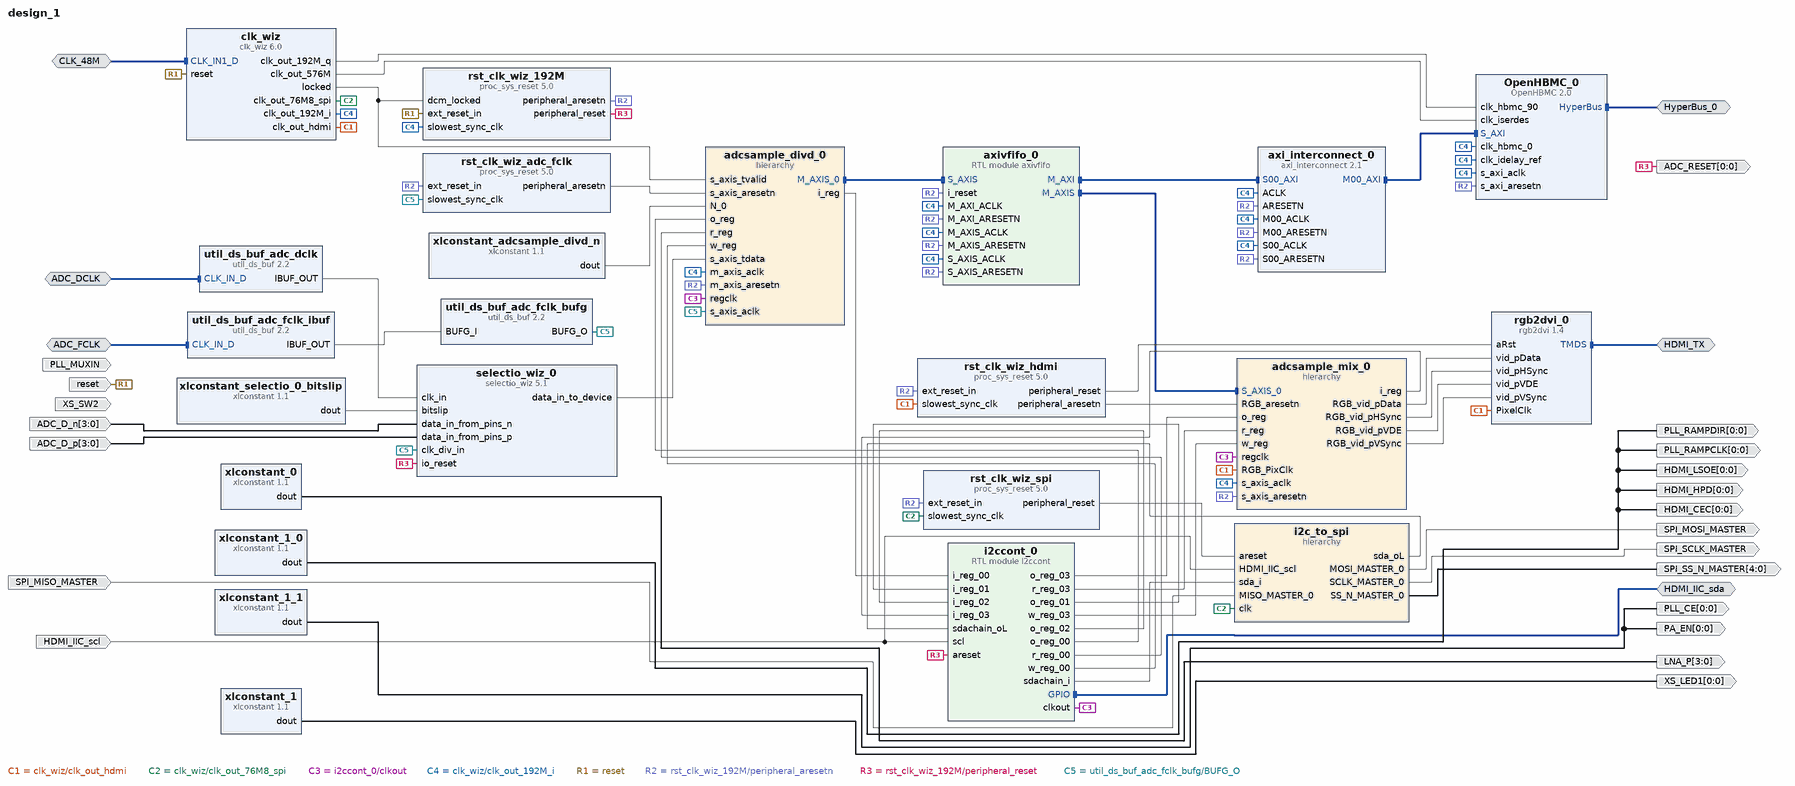
[diagram p0: block diagram of the top level]
# Vivado block design design_1, xc7s15csga225-1, Vivado 2021.2
create_bd_design design_1

create_bd_intf_port -mode Slave -vlnv xilinx.com:interface:diff_clock_rtl:1.0 ADC_FCLK
set_property -dict {CONFIG.FREQ_HZ 48000000} [get_bd_intf_ports ADC_FCLK]
create_bd_intf_port -mode Slave -vlnv xilinx.com:interface:diff_clock_rtl:1.0 ADC_DCLK
set_property -dict {CONFIG.FREQ_HZ 240000000} [get_bd_intf_ports ADC_DCLK]
create_bd_intf_port -mode Master -vlnv digilentinc.com:interface:tmds_rtl:1.0 HDMI_TX
create_bd_intf_port -mode Master -vlnv Cypress:user:HyperBus_rtl:1.0 HyperBus_0
create_bd_intf_port -mode Slave -vlnv xilinx.com:interface:diff_clock_rtl:1.0 CLK_48M
set_property -dict {CONFIG.FREQ_HZ 48000000} [get_bd_intf_ports CLK_48M]
create_bd_intf_port -mode Master -vlnv xilinx.com:interface:gpio_rtl:1.0 HDMI_IIC_sda
create_bd_port -dir I -from 3 -to 0 ADC_D_p
create_bd_port -dir I -from 3 -to 0 ADC_D_n
create_bd_port -dir I -type rst reset
set_property -dict {CONFIG.POLARITY ACTIVE_HIGH} [get_bd_ports reset]
create_bd_port -dir I HDMI_IIC_scl
create_bd_port -dir O -from 4 -to 0 SPI_SS_N_MASTER
create_bd_port -dir O SPI_MOSI_MASTER
create_bd_port -dir O SPI_SCLK_MASTER
create_bd_port -dir I SPI_MISO_MASTER
create_bd_port -dir I PLL_MUXIN
create_bd_port -dir O -from 0 -to 0 PLL_RAMPDIR
create_bd_port -dir O -from 0 -to 0 PLL_RAMPCLK
create_bd_port -dir O -from 0 -to 0 PA_EN
create_bd_port -dir O -from 0 -to 0 ADC_RESET
create_bd_port -dir O -from 3 -to 0 LNA_P
create_bd_port -dir I XS_SW2
create_bd_port -dir O -from 0 -to 0 XS_LED1
create_bd_port -dir O -from 0 -to 0 PLL_CE
create_bd_port -dir O -from 0 -to 0 HDMI_CEC
create_bd_port -dir O -from 0 -to 0 HDMI_LSOE
create_bd_port -dir O -from 0 -to 0 HDMI_HPD

create_bd_cell -type hier adcsample_divd_0
create_bd_cell -type hier adcsample_mix_0
create_bd_cell -type hier i2c_to_spi
create_bd_cell -type ip -vlnv OVGN:user:OpenHBMC:2.0 OpenHBMC_0
set_property -dict [list \
  CONFIG.C_DQ0_IDELAY_TAPS_VALUE 0 \
  CONFIG.C_DQ0_USE_IDELAY true \
  CONFIG.C_DQ1_USE_IDELAY true \
  CONFIG.C_DQ2_USE_IDELAY true \
  CONFIG.C_DQ3_USE_IDELAY true \
  CONFIG.C_DQ4_USE_IDELAY true \
  CONFIG.C_DQ5_USE_IDELAY true \
  CONFIG.C_DQ6_USE_IDELAY true \
  CONFIG.C_DQ7_USE_IDELAY true \
  CONFIG.C_HBMC_CLOCK_HZ 192000000 \
  CONFIG.C_IDELAYCTRL_INTEGRATED true \
  CONFIG.C_IODELAY_GROUP_ID HBMC \
  CONFIG.C_IODELAY_REFCLK_MHZ 192 \
  CONFIG.C_ISERDES_CLOCKING_MODE 1 \
  CONFIG.C_RWDS_USE_IDELAY true \
  CONFIG.C_S_AXI_DATA_WIDTH 32 \
] [get_bd_cells OpenHBMC_0]
create_bd_cell -type ip -vlnv xilinx.com:ip:axi_interconnect:2.1 axi_interconnect_0
set_property -dict [list \
  CONFIG.ENABLE_ADVANCED_OPTIONS 0 \
  CONFIG.M00_HAS_REGSLICE 3 \
  CONFIG.M01_HAS_REGSLICE 3 \
  CONFIG.NUM_MI 1 \
  CONFIG.NUM_SI 1 \
] [get_bd_cells axi_interconnect_0]
create_bd_cell -type module -reference axivfifo axivfifo_0
create_bd_cell -type ip -vlnv xilinx.com:ip:clk_wiz:6.0 clk_wiz
set_property -dict [list \
  CONFIG.CLKIN1_JITTER_PS 20.833 \
  CONFIG.CLKIN1_UI_JITTER 0.001 \
  CONFIG.CLKOUT1_DRIVES BUFG \
  CONFIG.CLKOUT1_JITTER 125.085 \
  CONFIG.CLKOUT1_MATCHED_ROUTING true \
  CONFIG.CLKOUT1_PHASE_ERROR 161.578 \
  CONFIG.CLKOUT1_REQUESTED_DUTY_CYCLE 50.0 \
  CONFIG.CLKOUT1_REQUESTED_OUT_FREQ 192 \
  CONFIG.CLKOUT2_DRIVES No_buffer \
  CONFIG.CLKOUT2_JITTER 103.345 \
  CONFIG.CLKOUT2_PHASE_ERROR 161.578 \
  CONFIG.CLKOUT2_REQUESTED_DUTY_CYCLE 50.0 \
  CONFIG.CLKOUT2_REQUESTED_OUT_FREQ 576 \
  CONFIG.CLKOUT2_REQUESTED_PHASE 0.000 \
  CONFIG.CLKOUT2_USED true \
  CONFIG.CLKOUT3_DRIVES BUFG \
  CONFIG.CLKOUT3_JITTER 125.085 \
  CONFIG.CLKOUT3_MATCHED_ROUTING true \
  CONFIG.CLKOUT3_PHASE_ERROR 161.578 \
  CONFIG.CLKOUT3_REQUESTED_DUTY_CYCLE 50.0 \
  CONFIG.CLKOUT3_REQUESTED_OUT_FREQ 192 \
  CONFIG.CLKOUT3_REQUESTED_PHASE 90.000 \
  CONFIG.CLKOUT3_USED true \
  CONFIG.CLKOUT4_DRIVES BUFG \
  CONFIG.CLKOUT4_JITTER 148.397 \
  CONFIG.CLKOUT4_PHASE_ERROR 161.578 \
  CONFIG.CLKOUT4_REQUESTED_DUTY_CYCLE 50.0 \
  CONFIG.CLKOUT4_REQUESTED_OUT_FREQ 72 \
  CONFIG.CLKOUT4_USED true \
  CONFIG.CLKOUT5_DRIVES No_buffer \
  CONFIG.CLKOUT5_JITTER 187.189 \
  CONFIG.CLKOUT5_PHASE_ERROR 161.578 \
  CONFIG.CLKOUT5_REQUESTED_DUTY_CYCLE 50.0 \
  CONFIG.CLKOUT5_REQUESTED_OUT_FREQ 19.2 \
  CONFIG.CLKOUT5_USED true \
  CONFIG.CLKOUT6_DRIVES BUFG \
  CONFIG.CLKOUT6_JITTER 146.733 \
  CONFIG.CLKOUT6_PHASE_ERROR 161.578 \
  CONFIG.CLKOUT6_REQUESTED_OUT_FREQ 76.8 \
  CONFIG.CLKOUT6_USED true \
  CONFIG.CLKOUT7_DRIVES BUFG \
  CONFIG.CLKOUT7_JITTER 110.889 \
  CONFIG.CLKOUT7_PHASE_ERROR 161.578 \
  CONFIG.CLKOUT7_REQUESTED_OUT_FREQ 100.000 \
  CONFIG.CLKOUT7_USED false \
  CONFIG.CLK_OUT1_PORT clk_out_192M_i \
  CONFIG.CLK_OUT2_PORT clk_out_576M \
  CONFIG.CLK_OUT3_PORT clk_out_192M_q \
  CONFIG.CLK_OUT4_PORT clk_out_hdmi \
  CONFIG.CLK_OUT5_PORT clk_out_19M2 \
  CONFIG.CLK_OUT6_PORT clk_out_76M8_spi \
  CONFIG.FEEDBACK_SOURCE FDBK_AUTO \
  CONFIG.JITTER_SEL No_Jitter \
  CONFIG.MMCM_BANDWIDTH OPTIMIZED \
  CONFIG.MMCM_CLKFBOUT_MULT_F 24.000 \
  CONFIG.MMCM_CLKIN1_PERIOD 20.833 \
  CONFIG.MMCM_CLKIN2_PERIOD 10.0 \
  CONFIG.MMCM_CLKOUT0_DIVIDE_F 6.000 \
  CONFIG.MMCM_CLKOUT1_DIVIDE 2 \
  CONFIG.MMCM_CLKOUT1_PHASE 0.000 \
  CONFIG.MMCM_CLKOUT2_DIVIDE 6 \
  CONFIG.MMCM_CLKOUT2_PHASE 90.000 \
  CONFIG.MMCM_CLKOUT3_DIVIDE 16 \
  CONFIG.MMCM_CLKOUT4_DIVIDE 60 \
  CONFIG.MMCM_CLKOUT5_DIVIDE 15 \
  CONFIG.MMCM_CLKOUT6_DIVIDE 1 \
  CONFIG.MMCM_COMPENSATION ZHOLD \
  CONFIG.MMCM_DIVCLK_DIVIDE 1 \
  CONFIG.MMCM_REF_JITTER1 0.001 \
  CONFIG.NUM_OUT_CLKS 6 \
  CONFIG.OVERRIDE_MMCM false \
  CONFIG.PRIM_IN_FREQ 48 \
  CONFIG.PRIM_SOURCE Differential_clock_capable_pin \
  CONFIG.USE_SAFE_CLOCK_STARTUP false \
  CONFIG.USE_SPREAD_SPECTRUM false \
] [get_bd_cells clk_wiz]
create_bd_cell -type module -reference i2ccont i2ccont_0
set_property -dict {CONFIG.device_address 0x55} [get_bd_cells i2ccont_0]
create_bd_cell -type ip -vlnv xilinx.com:ip:proc_sys_reset:5.0 rst_clk_wiz_adc_fclk
create_bd_cell -type ip -vlnv xilinx.com:ip:proc_sys_reset:5.0 rst_clk_wiz_hdmi
create_bd_cell -type ip -vlnv xilinx.com:ip:proc_sys_reset:5.0 rst_clk_wiz_spi
create_bd_cell -type ip -vlnv digilentinc.com:ip:rgb2dvi:1.4 rgb2dvi_0
set_property -dict {CONFIG.kClkRange 3 CONFIG.kGenerateSerialClk true} [get_bd_cells rgb2dvi_0]
create_bd_cell -type ip -vlnv xilinx.com:ip:proc_sys_reset:5.0 rst_clk_wiz_192M
create_bd_cell -type ip -vlnv xilinx.com:ip:selectio_wiz:5.1 selectio_wiz_0
set_property -dict [list \
  CONFIG.BUS_IO_STD LVDS_25 \
  CONFIG.BUS_SIG_TYPE DIFF \
  CONFIG.CLK_FWD_IO_STD LVDS_25 \
  CONFIG.CLK_FWD_SIG_TYPE DIFF \
  CONFIG.SELIO_ACTIVE_EDGE DDR \
  CONFIG.SELIO_CLK_BUF MMCM \
  CONFIG.SELIO_CLK_IO_STD LVDS_25 \
  CONFIG.SELIO_CLK_SIG_TYPE DIFF \
  CONFIG.SELIO_INTERFACE_TYPE NETWORKING \
  CONFIG.SERIALIZATION_FACTOR 6 \
  CONFIG.SYSTEM_DATA_WIDTH 4 \
  CONFIG.USE_SERIALIZATION true \
] [get_bd_cells selectio_wiz_0]
create_bd_cell -type ip -vlnv xilinx.com:ip:util_ds_buf:2.2 util_ds_buf_adc_fclk_ibuf
create_bd_cell -type ip -vlnv xilinx.com:ip:util_ds_buf:2.2 util_ds_buf_adc_dclk
set_property -dict {CONFIG.C_BUF_TYPE IBUFDS} [get_bd_cells util_ds_buf_adc_dclk]
create_bd_cell -type ip -vlnv xilinx.com:ip:util_ds_buf:2.2 util_ds_buf_adc_fclk_bufg
set_property -dict {CONFIG.C_BUF_TYPE BUFG} [get_bd_cells util_ds_buf_adc_fclk_bufg]
create_bd_cell -type ip -vlnv xilinx.com:ip:xlconstant:1.1 xlconstant_adcsample_divd_n
set_property -dict {CONFIG.CONST_VAL 96000 CONFIG.CONST_WIDTH 20} [get_bd_cells xlconstant_adcsample_divd_n]
create_bd_cell -type ip -vlnv xilinx.com:ip:xlconstant:1.1 xlconstant_1_0
set_property -dict {CONFIG.CONST_VAL 0} [get_bd_cells xlconstant_1_0]
create_bd_cell -type ip -vlnv xilinx.com:ip:xlconstant:1.1 xlconstant_1_1
create_bd_cell -type ip -vlnv xilinx.com:ip:xlconstant:1.1 xlconstant_0
set_property -dict {CONFIG.CONST_VAL 0b1010 CONFIG.CONST_WIDTH 4} [get_bd_cells xlconstant_0]
create_bd_cell -type ip -vlnv xilinx.com:ip:xlconstant:1.1 xlconstant_selectio_0_bitslip
set_property -dict {CONFIG.CONST_VAL 0 CONFIG.CONST_WIDTH 4} [get_bd_cells xlconstant_selectio_0_bitslip]
create_bd_cell -type ip -vlnv xilinx.com:ip:xlconstant:1.1 xlconstant_1

# ---- hierarchy /adcsample_divd_0 ----
current_bd_instance /adcsample_divd_0
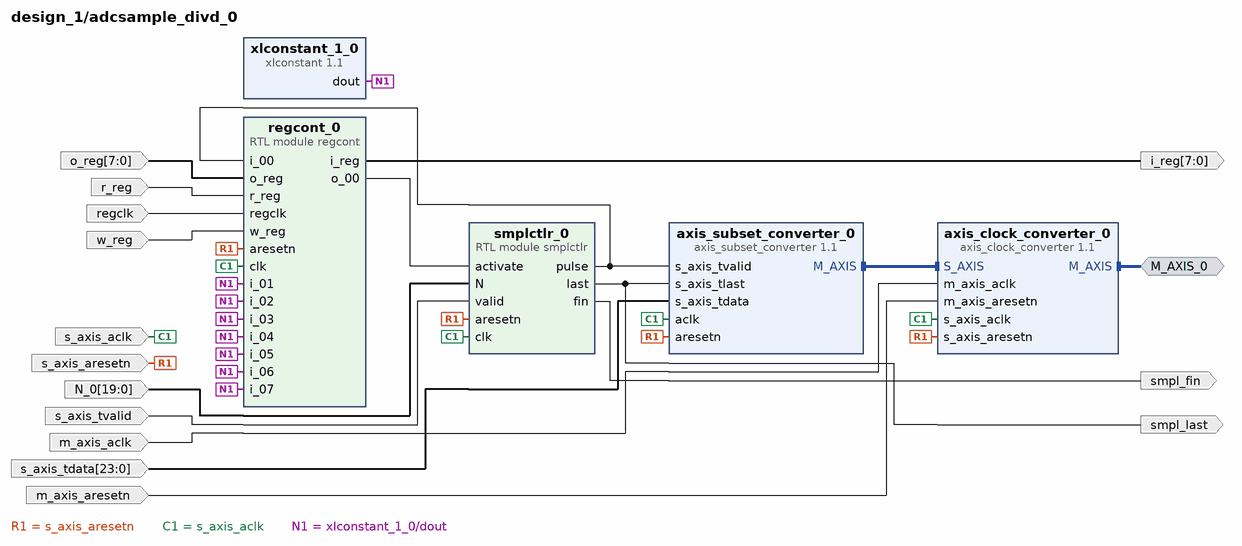
[diagram p1: block diagram inside /adcsample_divd_0]
create_bd_intf_pin -mode Master -vlnv xilinx.com:interface:axis_rtl:1.0 M_AXIS_0
create_bd_pin -dir I -type clk s_axis_aclk
create_bd_pin -dir I -from 23 -to 0 s_axis_tdata
create_bd_pin -dir I s_axis_tvalid
create_bd_pin -dir I -type rst s_axis_aresetn
create_bd_pin -dir I -type rst m_axis_aresetn
create_bd_pin -dir I -type clk m_axis_aclk
create_bd_pin -dir I -from 19 -to 0 N_0
create_bd_pin -dir O smpl_fin
create_bd_pin -dir O smpl_last
create_bd_pin -dir I w_reg
create_bd_pin -dir I regclk
create_bd_pin -dir O -from 7 -to 0 i_reg
create_bd_pin -dir I -from 7 -to 0 o_reg
create_bd_pin -dir I r_reg

create_bd_cell -type ip -vlnv xilinx.com:ip:axis_clock_converter:1.1 axis_clock_converter_0
set_property -dict {CONFIG.IS_ACLK_ASYNC 1} [get_bd_cells axis_clock_converter_0]
create_bd_cell -type ip -vlnv xilinx.com:ip:axis_subset_converter:1.1 axis_subset_converter_0
set_property -dict [list \
  CONFIG.M_HAS_TLAST 0 \
  CONFIG.M_HAS_TREADY 1 \
  CONFIG.M_TDATA_NUM_BYTES 4 \
  CONFIG.S_HAS_TKEEP 0 \
  CONFIG.S_HAS_TLAST 1 \
  CONFIG.S_HAS_TREADY 0 \
  CONFIG.S_HAS_TSTRB 0 \
  CONFIG.S_TDATA_NUM_BYTES 3 \
  CONFIG.S_TDEST_WIDTH 0 \
  CONFIG.S_TID_WIDTH 0 \
  CONFIG.S_TUSER_WIDTH 0 \
  CONFIG.TDATA_REMAP {tlast[0:0],7'b0000000,tdata[23:0]} \
  CONFIG.TLAST_REMAP {1'b0} \
] [get_bd_cells axis_subset_converter_0]
create_bd_cell -type module -reference regcont regcont_0
create_bd_cell -type module -reference smplctlr smplctlr_0
create_bd_cell -type ip -vlnv xilinx.com:ip:xlconstant:1.1 xlconstant_1_0
set_property -dict {CONFIG.CONST_VAL 0} [get_bd_cells xlconstant_1_0]

# ---- hierarchy /adcsample_mix_0 ----
current_bd_instance /adcsample_mix_0
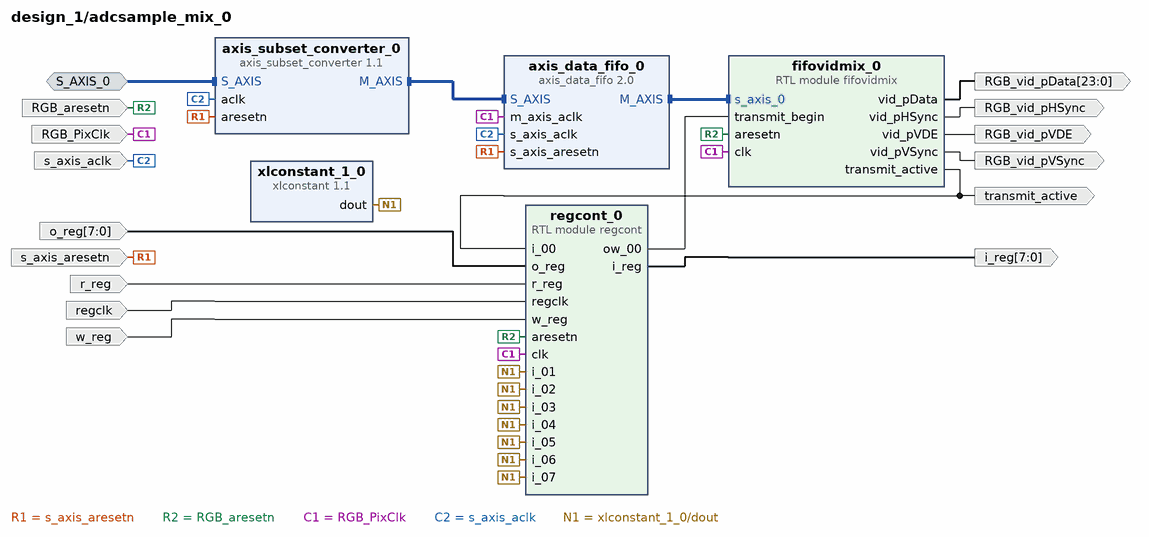
[diagram p2: block diagram inside /adcsample_mix_0]
create_bd_intf_pin -mode Slave -vlnv xilinx.com:interface:axis_rtl:1.0 S_AXIS_0
create_bd_pin -dir I -type clk s_axis_aclk
create_bd_pin -dir I -type rst s_axis_aresetn
create_bd_pin -dir O RGB_vid_pVDE
create_bd_pin -dir O RGB_vid_pHSync
create_bd_pin -dir O -from 23 -to 0 RGB_vid_pData
create_bd_pin -dir O RGB_vid_pVSync
create_bd_pin -dir I -type clk RGB_PixClk
create_bd_pin -dir I -type rst RGB_aresetn
create_bd_pin -dir O transmit_active
create_bd_pin -dir I regclk
create_bd_pin -dir I r_reg
create_bd_pin -dir I w_reg
create_bd_pin -dir I -from 7 -to 0 o_reg
create_bd_pin -dir O -from 7 -to 0 i_reg

create_bd_cell -type ip -vlnv xilinx.com:ip:axis_data_fifo:2.0 axis_data_fifo_0
set_property -dict [list \
  CONFIG.FIFO_DEPTH 1024 \
  CONFIG.FIFO_MEMORY_TYPE auto \
  CONFIG.HAS_TLAST 1 \
  CONFIG.IS_ACLK_ASYNC 1 \
  CONFIG.TDATA_NUM_BYTES 3 \
] [get_bd_cells axis_data_fifo_0]
create_bd_cell -type ip -vlnv xilinx.com:ip:axis_subset_converter:1.1 axis_subset_converter_0
set_property -dict [list \
  CONFIG.M_HAS_TLAST 1 \
  CONFIG.M_HAS_TREADY 1 \
  CONFIG.M_TDATA_NUM_BYTES 3 \
  CONFIG.M_TUSER_WIDTH 0 \
  CONFIG.S_HAS_TKEEP 0 \
  CONFIG.S_HAS_TLAST 0 \
  CONFIG.S_HAS_TREADY 1 \
  CONFIG.S_HAS_TSTRB 0 \
  CONFIG.S_TDATA_NUM_BYTES 4 \
  CONFIG.S_TDEST_WIDTH 0 \
  CONFIG.S_TID_WIDTH 0 \
  CONFIG.S_TUSER_WIDTH 0 \
  CONFIG.TDATA_REMAP {tdata[23:0]} \
  CONFIG.TLAST_REMAP {tdata[31:31]} \
] [get_bd_cells axis_subset_converter_0]
create_bd_cell -type module -reference fifovidmix fifovidmix_0
create_bd_cell -type module -reference regcont regcont_0
create_bd_cell -type ip -vlnv xilinx.com:ip:xlconstant:1.1 xlconstant_1_0
set_property -dict {CONFIG.CONST_VAL 0} [get_bd_cells xlconstant_1_0]

# ---- hierarchy /i2c_to_spi ----
current_bd_instance /i2c_to_spi
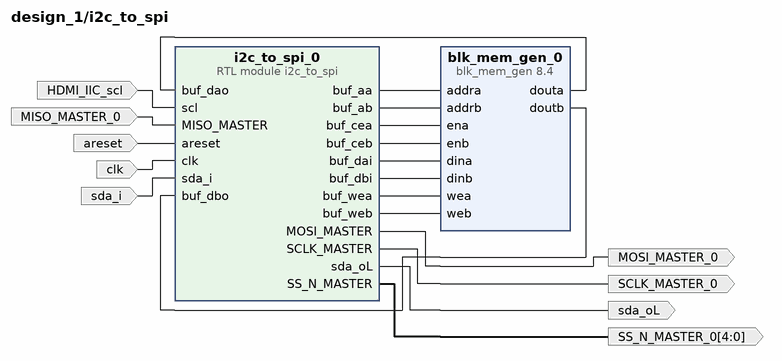
[diagram p3: block diagram inside /i2c_to_spi]
create_bd_pin -dir I -type clk clk
create_bd_pin -dir I areset
create_bd_pin -dir O -from 4 -to 0 SS_N_MASTER_0
create_bd_pin -dir O MOSI_MASTER_0
create_bd_pin -dir O SCLK_MASTER_0
create_bd_pin -dir I MISO_MASTER_0
create_bd_pin -dir I HDMI_IIC_scl
create_bd_pin -dir O sda_oL
create_bd_pin -dir I sda_i

create_bd_cell -type ip -vlnv xilinx.com:ip:blk_mem_gen:8.4 blk_mem_gen_0
set_property -dict [list \
  CONFIG.Enable_32bit_Address false \
  CONFIG.Enable_B Use_ENB_Pin \
  CONFIG.Fill_Remaining_Memory_Locations false \
  CONFIG.Memory_Type True_Dual_Port_RAM \
  CONFIG.Port_B_Clock 100 \
  CONFIG.Port_B_Enable_Rate 100 \
  CONFIG.Port_B_Write_Rate 50 \
  CONFIG.Read_Width_A 8 \
  CONFIG.Read_Width_B 8 \
  CONFIG.Register_PortA_Output_of_Memory_Primitives false \
  CONFIG.Register_PortB_Output_of_Memory_Primitives false \
  CONFIG.Use_Byte_Write_Enable false \
  CONFIG.Use_RSTA_Pin false \
  CONFIG.Write_Depth_A 128 \
  CONFIG.Write_Width_A 8 \
  CONFIG.Write_Width_B 8 \
  CONFIG.use_bram_block Stand_Alone \
] [get_bd_cells blk_mem_gen_0]
create_bd_cell -type module -reference i2c_to_spi i2c_to_spi_0
set_property -dict {CONFIG.CLOCK_SEL 1 CONFIG.I2C_SLAVE_ADDR 0x54} [get_bd_cells i2c_to_spi_0]

# ---- connections ----

current_bd_instance /adcsample_divd_0
connect_bd_intf_net [get_bd_intf_pins M_AXIS_0] [get_bd_intf_pins axis_clock_converter_0/M_AXIS]
connect_bd_intf_net [get_bd_intf_pins axis_clock_converter_0/S_AXIS] [get_bd_intf_pins axis_subset_converter_0/M_AXIS]
connect_bd_net -net N_0_1 [get_bd_pins N_0] [get_bd_pins smplctlr_0/N]
connect_bd_net -net aresetn_1 [get_bd_pins s_axis_aresetn] \
  [get_bd_pins axis_clock_converter_0/s_axis_aresetn] [get_bd_pins axis_subset_converter_0/aresetn] \
  [get_bd_pins regcont_0/aresetn] [get_bd_pins smplctlr_0/aresetn]
connect_bd_net [get_bd_pins m_axis_aclk] [get_bd_pins axis_clock_converter_0/m_axis_aclk]
connect_bd_net [get_bd_pins m_axis_aresetn] [get_bd_pins axis_clock_converter_0/m_axis_aresetn]
connect_bd_net [get_bd_pins o_reg] [get_bd_pins regcont_0/o_reg]
connect_bd_net [get_bd_pins r_reg] [get_bd_pins regcont_0/r_reg]
connect_bd_net [get_bd_pins regclk] [get_bd_pins regcont_0/regclk]
connect_bd_net [get_bd_pins regcont_0/i_reg] [get_bd_pins i_reg]
connect_bd_net [get_bd_pins regcont_0/o_00] [get_bd_pins smplctlr_0/activate]
connect_bd_net [get_bd_pins s_axis_tdata] [get_bd_pins axis_subset_converter_0/s_axis_tdata]
connect_bd_net [get_bd_pins s_axis_tvalid] [get_bd_pins smplctlr_0/valid]
connect_bd_net -net selectio_wiz_0_clk_div_out [get_bd_pins s_axis_aclk] \
  [get_bd_pins axis_clock_converter_0/s_axis_aclk] [get_bd_pins axis_subset_converter_0/aclk] [get_bd_pins regcont_0/clk] \
  [get_bd_pins smplctlr_0/clk]
connect_bd_net [get_bd_pins smplctlr_0/fin] [get_bd_pins smpl_fin]
connect_bd_net [get_bd_pins smplctlr_0/last] [get_bd_pins smpl_last] [get_bd_pins axis_subset_converter_0/s_axis_tlast]
connect_bd_net [get_bd_pins smplctlr_0/pulse] [get_bd_pins axis_subset_converter_0/s_axis_tvalid] [get_bd_pins regcont_0/i_00]
connect_bd_net [get_bd_pins w_reg] [get_bd_pins regcont_0/w_reg]
connect_bd_net [get_bd_pins xlconstant_1_0/dout] \
  [get_bd_pins regcont_0/i_01] [get_bd_pins regcont_0/i_02] [get_bd_pins regcont_0/i_03] [get_bd_pins regcont_0/i_04] \
  [get_bd_pins regcont_0/i_05] [get_bd_pins regcont_0/i_06] [get_bd_pins regcont_0/i_07]

current_bd_instance /adcsample_mix_0
connect_bd_intf_net [get_bd_intf_pins S_AXIS_0] [get_bd_intf_pins axis_subset_converter_0/S_AXIS]
connect_bd_intf_net [get_bd_intf_pins axis_data_fifo_0/M_AXIS] [get_bd_intf_pins fifovidmix_0/s_axis_0]
connect_bd_intf_net [get_bd_intf_pins axis_data_fifo_0/S_AXIS] [get_bd_intf_pins axis_subset_converter_0/M_AXIS]
connect_bd_net -net aresetn_1 [get_bd_pins s_axis_aresetn] [get_bd_pins axis_data_fifo_0/s_axis_aresetn] [get_bd_pins axis_subset_converter_0/aresetn]
connect_bd_net -net aresetn_2 [get_bd_pins RGB_aresetn] [get_bd_pins fifovidmix_0/aresetn] [get_bd_pins regcont_0/aresetn]
connect_bd_net [get_bd_pins fifovidmix_0/transmit_active] [get_bd_pins transmit_active] [get_bd_pins regcont_0/i_00]
connect_bd_net [get_bd_pins fifovidmix_0/vid_pData] [get_bd_pins RGB_vid_pData]
connect_bd_net [get_bd_pins fifovidmix_0/vid_pHSync] [get_bd_pins RGB_vid_pHSync]
connect_bd_net [get_bd_pins fifovidmix_0/vid_pVDE] [get_bd_pins RGB_vid_pVDE]
connect_bd_net [get_bd_pins fifovidmix_0/vid_pVSync] [get_bd_pins RGB_vid_pVSync]
connect_bd_net -net m_axis_aclk_0_1 [get_bd_pins RGB_PixClk] \
  [get_bd_pins axis_data_fifo_0/m_axis_aclk] [get_bd_pins fifovidmix_0/clk] [get_bd_pins regcont_0/clk]
connect_bd_net [get_bd_pins o_reg] [get_bd_pins regcont_0/o_reg]
connect_bd_net [get_bd_pins r_reg] [get_bd_pins regcont_0/r_reg]
connect_bd_net [get_bd_pins regclk] [get_bd_pins regcont_0/regclk]
connect_bd_net [get_bd_pins regcont_0/i_reg] [get_bd_pins i_reg]
connect_bd_net [get_bd_pins regcont_0/ow_00] [get_bd_pins fifovidmix_0/transmit_begin]
connect_bd_net -net selectio_wiz_0_clk_div_out [get_bd_pins s_axis_aclk] \
  [get_bd_pins axis_data_fifo_0/s_axis_aclk] [get_bd_pins axis_subset_converter_0/aclk]
connect_bd_net [get_bd_pins w_reg] [get_bd_pins regcont_0/w_reg]
connect_bd_net [get_bd_pins xlconstant_1_0/dout] \
  [get_bd_pins regcont_0/i_01] [get_bd_pins regcont_0/i_02] [get_bd_pins regcont_0/i_03] [get_bd_pins regcont_0/i_04] \
  [get_bd_pins regcont_0/i_05] [get_bd_pins regcont_0/i_06] [get_bd_pins regcont_0/i_07]

current_bd_instance /i2c_to_spi
connect_bd_net [get_bd_pins HDMI_IIC_scl] [get_bd_pins i2c_to_spi_0/scl]
connect_bd_net -net MISO_MASTER_0_1 [get_bd_pins MISO_MASTER_0] [get_bd_pins i2c_to_spi_0/MISO_MASTER]
connect_bd_net [get_bd_pins areset] [get_bd_pins i2c_to_spi_0/areset]
connect_bd_net [get_bd_pins blk_mem_gen_0/douta] [get_bd_pins i2c_to_spi_0/buf_dao]
connect_bd_net [get_bd_pins blk_mem_gen_0/doutb] [get_bd_pins i2c_to_spi_0/buf_dbo]
connect_bd_net [get_bd_pins clk] [get_bd_pins i2c_to_spi_0/clk]
connect_bd_net [get_bd_pins i2c_to_spi_0/MOSI_MASTER] [get_bd_pins MOSI_MASTER_0]
connect_bd_net [get_bd_pins i2c_to_spi_0/SCLK_MASTER] [get_bd_pins SCLK_MASTER_0]
connect_bd_net [get_bd_pins i2c_to_spi_0/SS_N_MASTER] [get_bd_pins SS_N_MASTER_0]
connect_bd_net [get_bd_pins i2c_to_spi_0/buf_aa] [get_bd_pins blk_mem_gen_0/addra]
connect_bd_net [get_bd_pins i2c_to_spi_0/buf_ab] [get_bd_pins blk_mem_gen_0/addrb]
connect_bd_net [get_bd_pins i2c_to_spi_0/buf_cea] [get_bd_pins blk_mem_gen_0/ena]
connect_bd_net [get_bd_pins i2c_to_spi_0/buf_ceb] [get_bd_pins blk_mem_gen_0/enb]
connect_bd_net [get_bd_pins i2c_to_spi_0/buf_dai] [get_bd_pins blk_mem_gen_0/dina]
connect_bd_net [get_bd_pins i2c_to_spi_0/buf_dbi] [get_bd_pins blk_mem_gen_0/dinb]
connect_bd_net [get_bd_pins i2c_to_spi_0/buf_wea] [get_bd_pins blk_mem_gen_0/wea]
connect_bd_net [get_bd_pins i2c_to_spi_0/buf_web] [get_bd_pins blk_mem_gen_0/web]
connect_bd_net [get_bd_pins i2c_to_spi_0/sda_oL] [get_bd_pins sda_oL]
connect_bd_net [get_bd_pins sda_i] [get_bd_pins i2c_to_spi_0/sda_i]

current_bd_instance /
connect_bd_intf_net [get_bd_intf_ports ADC_DCLK] [get_bd_intf_pins util_ds_buf_adc_dclk/CLK_IN_D]
connect_bd_intf_net -intf_net CLK_IN1_D_0_1 [get_bd_intf_ports CLK_48M] [get_bd_intf_pins clk_wiz/CLK_IN1_D]
connect_bd_intf_net -intf_net CLK_IN1_D_FCLK_1 [get_bd_intf_ports ADC_FCLK] [get_bd_intf_pins util_ds_buf_adc_fclk_ibuf/CLK_IN_D]
connect_bd_intf_net [get_bd_intf_ports HyperBus_0] [get_bd_intf_pins OpenHBMC_0/HyperBus]
connect_bd_intf_net [get_bd_intf_pins axi_interconnect_0/S00_AXI] [get_bd_intf_pins axivfifo_0/M_AXI]
connect_bd_intf_net -intf_net S_AXIS_0_1 [get_bd_intf_pins adcsample_mix_0/S_AXIS_0] [get_bd_intf_pins axivfifo_0/M_AXIS]
connect_bd_intf_net [get_bd_intf_pins adcsample_divd_0/M_AXIS_0] [get_bd_intf_pins axivfifo_0/S_AXIS]
connect_bd_intf_net [get_bd_intf_pins OpenHBMC_0/S_AXI] [get_bd_intf_pins axi_interconnect_0/M00_AXI]
connect_bd_intf_net [get_bd_intf_ports HDMI_IIC_sda] [get_bd_intf_pins i2ccont_0/GPIO]
connect_bd_intf_net [get_bd_intf_ports HDMI_TX] [get_bd_intf_pins rgb2dvi_0/TMDS]
connect_bd_net -net MISO_MASTER_0_1 [get_bd_ports SPI_MISO_MASTER] [get_bd_pins i2c_to_spi/MISO_MASTER_0]
connect_bd_net -net RGB_PixClk_1 [get_bd_pins clk_wiz/clk_out_hdmi] \
  [get_bd_pins adcsample_mix_0/RGB_PixClk] [get_bd_pins rst_clk_wiz_hdmi/slowest_sync_clk] [get_bd_pins rgb2dvi_0/PixelClk]
connect_bd_net [get_bd_pins adcsample_divd_0/i_reg] [get_bd_pins i2ccont_0/i_reg_00]
connect_bd_net [get_bd_pins adcsample_mix_0/RGB_vid_pData] [get_bd_pins rgb2dvi_0/vid_pData]
connect_bd_net [get_bd_pins adcsample_mix_0/RGB_vid_pHSync] [get_bd_pins rgb2dvi_0/vid_pHSync]
connect_bd_net [get_bd_pins adcsample_mix_0/RGB_vid_pVDE] [get_bd_pins rgb2dvi_0/vid_pVDE]
connect_bd_net [get_bd_pins adcsample_mix_0/RGB_vid_pVSync] [get_bd_pins rgb2dvi_0/vid_pVSync]
connect_bd_net [get_bd_pins adcsample_mix_0/i_reg] [get_bd_pins i2ccont_0/i_reg_03]
connect_bd_net -net clk_wiz_0_clk_out_192M_q [get_bd_pins clk_wiz/clk_out_192M_q] [get_bd_pins OpenHBMC_0/clk_hbmc_90]
connect_bd_net -net clk_wiz_0_clk_out_576M [get_bd_pins clk_wiz/clk_out_576M] [get_bd_pins OpenHBMC_0/clk_iserdes]
connect_bd_net -net clk_wiz_0_locked [get_bd_pins clk_wiz/locked] \
  [get_bd_pins adcsample_divd_0/s_axis_tvalid] [get_bd_pins rst_clk_wiz_192M/dcm_locked]
connect_bd_net [get_bd_pins clk_wiz/clk_out_76M8_spi] [get_bd_pins i2c_to_spi/clk] [get_bd_pins rst_clk_wiz_spi/slowest_sync_clk]
connect_bd_net -net data_in_from_pins_n_0_1 [get_bd_ports ADC_D_n] [get_bd_pins selectio_wiz_0/data_in_from_pins_n]
connect_bd_net -net data_in_from_pins_p_0_1 [get_bd_ports ADC_D_p] [get_bd_pins selectio_wiz_0/data_in_from_pins_p]
connect_bd_net [get_bd_pins i2c_to_spi/MOSI_MASTER_0] [get_bd_ports SPI_MOSI_MASTER]
connect_bd_net [get_bd_pins i2c_to_spi/SCLK_MASTER_0] [get_bd_ports SPI_SCLK_MASTER]
connect_bd_net [get_bd_pins i2c_to_spi/SS_N_MASTER_0] [get_bd_ports SPI_SS_N_MASTER]
connect_bd_net [get_bd_pins i2c_to_spi/sda_oL] [get_bd_pins i2ccont_0/sdachain_oL]
connect_bd_net [get_bd_pins i2ccont_0/clkout] [get_bd_pins adcsample_divd_0/regclk] [get_bd_pins adcsample_mix_0/regclk]
connect_bd_net [get_bd_pins i2ccont_0/o_reg_00] [get_bd_pins adcsample_divd_0/o_reg]
connect_bd_net [get_bd_pins i2ccont_0/o_reg_01] [get_bd_pins i2ccont_0/i_reg_01]
connect_bd_net [get_bd_pins i2ccont_0/o_reg_02] [get_bd_pins i2ccont_0/i_reg_02]
connect_bd_net [get_bd_pins i2ccont_0/o_reg_03] [get_bd_pins adcsample_mix_0/o_reg]
connect_bd_net [get_bd_pins i2ccont_0/r_reg_00] [get_bd_pins adcsample_divd_0/r_reg]
connect_bd_net [get_bd_pins i2ccont_0/r_reg_03] [get_bd_pins adcsample_mix_0/r_reg]
connect_bd_net [get_bd_pins i2ccont_0/sdachain_i] [get_bd_pins i2c_to_spi/sda_i]
connect_bd_net [get_bd_pins i2ccont_0/w_reg_00] [get_bd_pins adcsample_divd_0/w_reg]
connect_bd_net [get_bd_pins i2ccont_0/w_reg_03] [get_bd_pins adcsample_mix_0/w_reg]
connect_bd_net -net microblaze_0_Clk [get_bd_pins clk_wiz/clk_out_192M_i] \
  [get_bd_pins adcsample_divd_0/m_axis_aclk] [get_bd_pins adcsample_mix_0/s_axis_aclk] [get_bd_pins OpenHBMC_0/clk_hbmc_0] \
  [get_bd_pins OpenHBMC_0/clk_idelay_ref] [get_bd_pins OpenHBMC_0/s_axi_aclk] [get_bd_pins axi_interconnect_0/ACLK] \
  [get_bd_pins axi_interconnect_0/S00_ACLK] [get_bd_pins axi_interconnect_0/M00_ACLK] [get_bd_pins axivfifo_0/M_AXI_ACLK] \
  [get_bd_pins axivfifo_0/S_AXIS_ACLK] [get_bd_pins axivfifo_0/M_AXIS_ACLK] [get_bd_pins rst_clk_wiz_192M/slowest_sync_clk]
connect_bd_net [get_bd_ports reset] [get_bd_pins clk_wiz/reset] [get_bd_pins rst_clk_wiz_192M/ext_reset_in]
connect_bd_net -net rst_clk_wiz_0_120M_peripheral_aresetn [get_bd_pins rst_clk_wiz_192M/peripheral_aresetn] \
  [get_bd_pins adcsample_mix_0/s_axis_aresetn] [get_bd_pins adcsample_divd_0/m_axis_aresetn] \
  [get_bd_pins OpenHBMC_0/s_axi_aresetn] [get_bd_pins axi_interconnect_0/ARESETN] \
  [get_bd_pins axi_interconnect_0/S00_ARESETN] [get_bd_pins axi_interconnect_0/M00_ARESETN] \
  [get_bd_pins axivfifo_0/M_AXI_ARESETN] [get_bd_pins axivfifo_0/S_AXIS_ARESETN] [get_bd_pins axivfifo_0/M_AXIS_ARESETN] \
  [get_bd_pins axivfifo_0/i_reset] [get_bd_pins rst_clk_wiz_adc_fclk/ext_reset_in] \
  [get_bd_pins rst_clk_wiz_hdmi/ext_reset_in] [get_bd_pins rst_clk_wiz_spi/ext_reset_in]
connect_bd_net -net rst_clk_wiz_0_120M_peripheral_reset [get_bd_pins rst_clk_wiz_192M/peripheral_reset] \
  [get_bd_ports ADC_RESET] [get_bd_pins i2ccont_0/areset] [get_bd_pins selectio_wiz_0/io_reset]
connect_bd_net [get_bd_pins rst_clk_wiz_hdmi/peripheral_aresetn] [get_bd_pins adcsample_mix_0/RGB_aresetn]
connect_bd_net [get_bd_pins rst_clk_wiz_hdmi/peripheral_reset] [get_bd_pins rgb2dvi_0/aRst]
connect_bd_net [get_bd_pins rst_clk_wiz_spi/peripheral_reset] [get_bd_pins i2c_to_spi/areset]
connect_bd_net -net s_axis_aresetn_1 [get_bd_pins rst_clk_wiz_adc_fclk/peripheral_aresetn] [get_bd_pins adcsample_divd_0/s_axis_aresetn]
connect_bd_net -net scl_0_1 [get_bd_ports HDMI_IIC_scl] [get_bd_pins i2c_to_spi/HDMI_IIC_scl] [get_bd_pins i2ccont_0/scl]
connect_bd_net [get_bd_pins selectio_wiz_0/data_in_to_device] [get_bd_pins adcsample_divd_0/s_axis_tdata]
connect_bd_net -net util_ds_buf_0_IBUF_OUT [get_bd_pins util_ds_buf_adc_fclk_bufg/BUFG_O] \
  [get_bd_pins adcsample_divd_0/s_axis_aclk] [get_bd_pins rst_clk_wiz_adc_fclk/slowest_sync_clk] \
  [get_bd_pins selectio_wiz_0/clk_div_in]
connect_bd_net -net util_ds_buf_1_IBUF_OUT [get_bd_pins util_ds_buf_adc_dclk/IBUF_OUT] [get_bd_pins selectio_wiz_0/clk_in]
connect_bd_net [get_bd_pins util_ds_buf_adc_fclk_ibuf/IBUF_OUT] [get_bd_pins util_ds_buf_adc_fclk_bufg/BUFG_I]
connect_bd_net -net xlconstant_0_dout [get_bd_pins xlconstant_adcsample_divd_n/dout] [get_bd_pins adcsample_divd_0/N_0]
connect_bd_net [get_bd_pins xlconstant_0/dout] [get_bd_ports LNA_P]
connect_bd_net [get_bd_pins xlconstant_1_0/dout] \
  [get_bd_ports PLL_RAMPCLK] [get_bd_ports PLL_RAMPDIR] [get_bd_ports HDMI_HPD] [get_bd_ports HDMI_CEC] \
  [get_bd_ports HDMI_LSOE]
connect_bd_net [get_bd_pins xlconstant_1_1/dout] [get_bd_ports PA_EN] [get_bd_ports PLL_CE]
connect_bd_net -net xlconstant_1_dout [get_bd_pins xlconstant_selectio_0_bitslip/dout] [get_bd_pins selectio_wiz_0/bitslip]
connect_bd_net [get_bd_pins xlconstant_1/dout] [get_bd_ports XS_LED1]

# ---- address map ----
assign_bd_address -offset 0x76000000 -range 8M -target_address_space [get_bd_addr_spaces axivfifo_0/M_AXI] [get_bd_addr_segs OpenHBMC_0/S_AXI/Mem]

validate_bd_design
save_bd_design
